# Altium schematic sheet Fri3D_2026_02.SchDoc: Top Level
size A3; Date: 27/02/2026; DrawnBy: Wim Van Gool; DocumentNumber: 1; Revision: 01; SheetNumber: 1; SheetTotal: 5
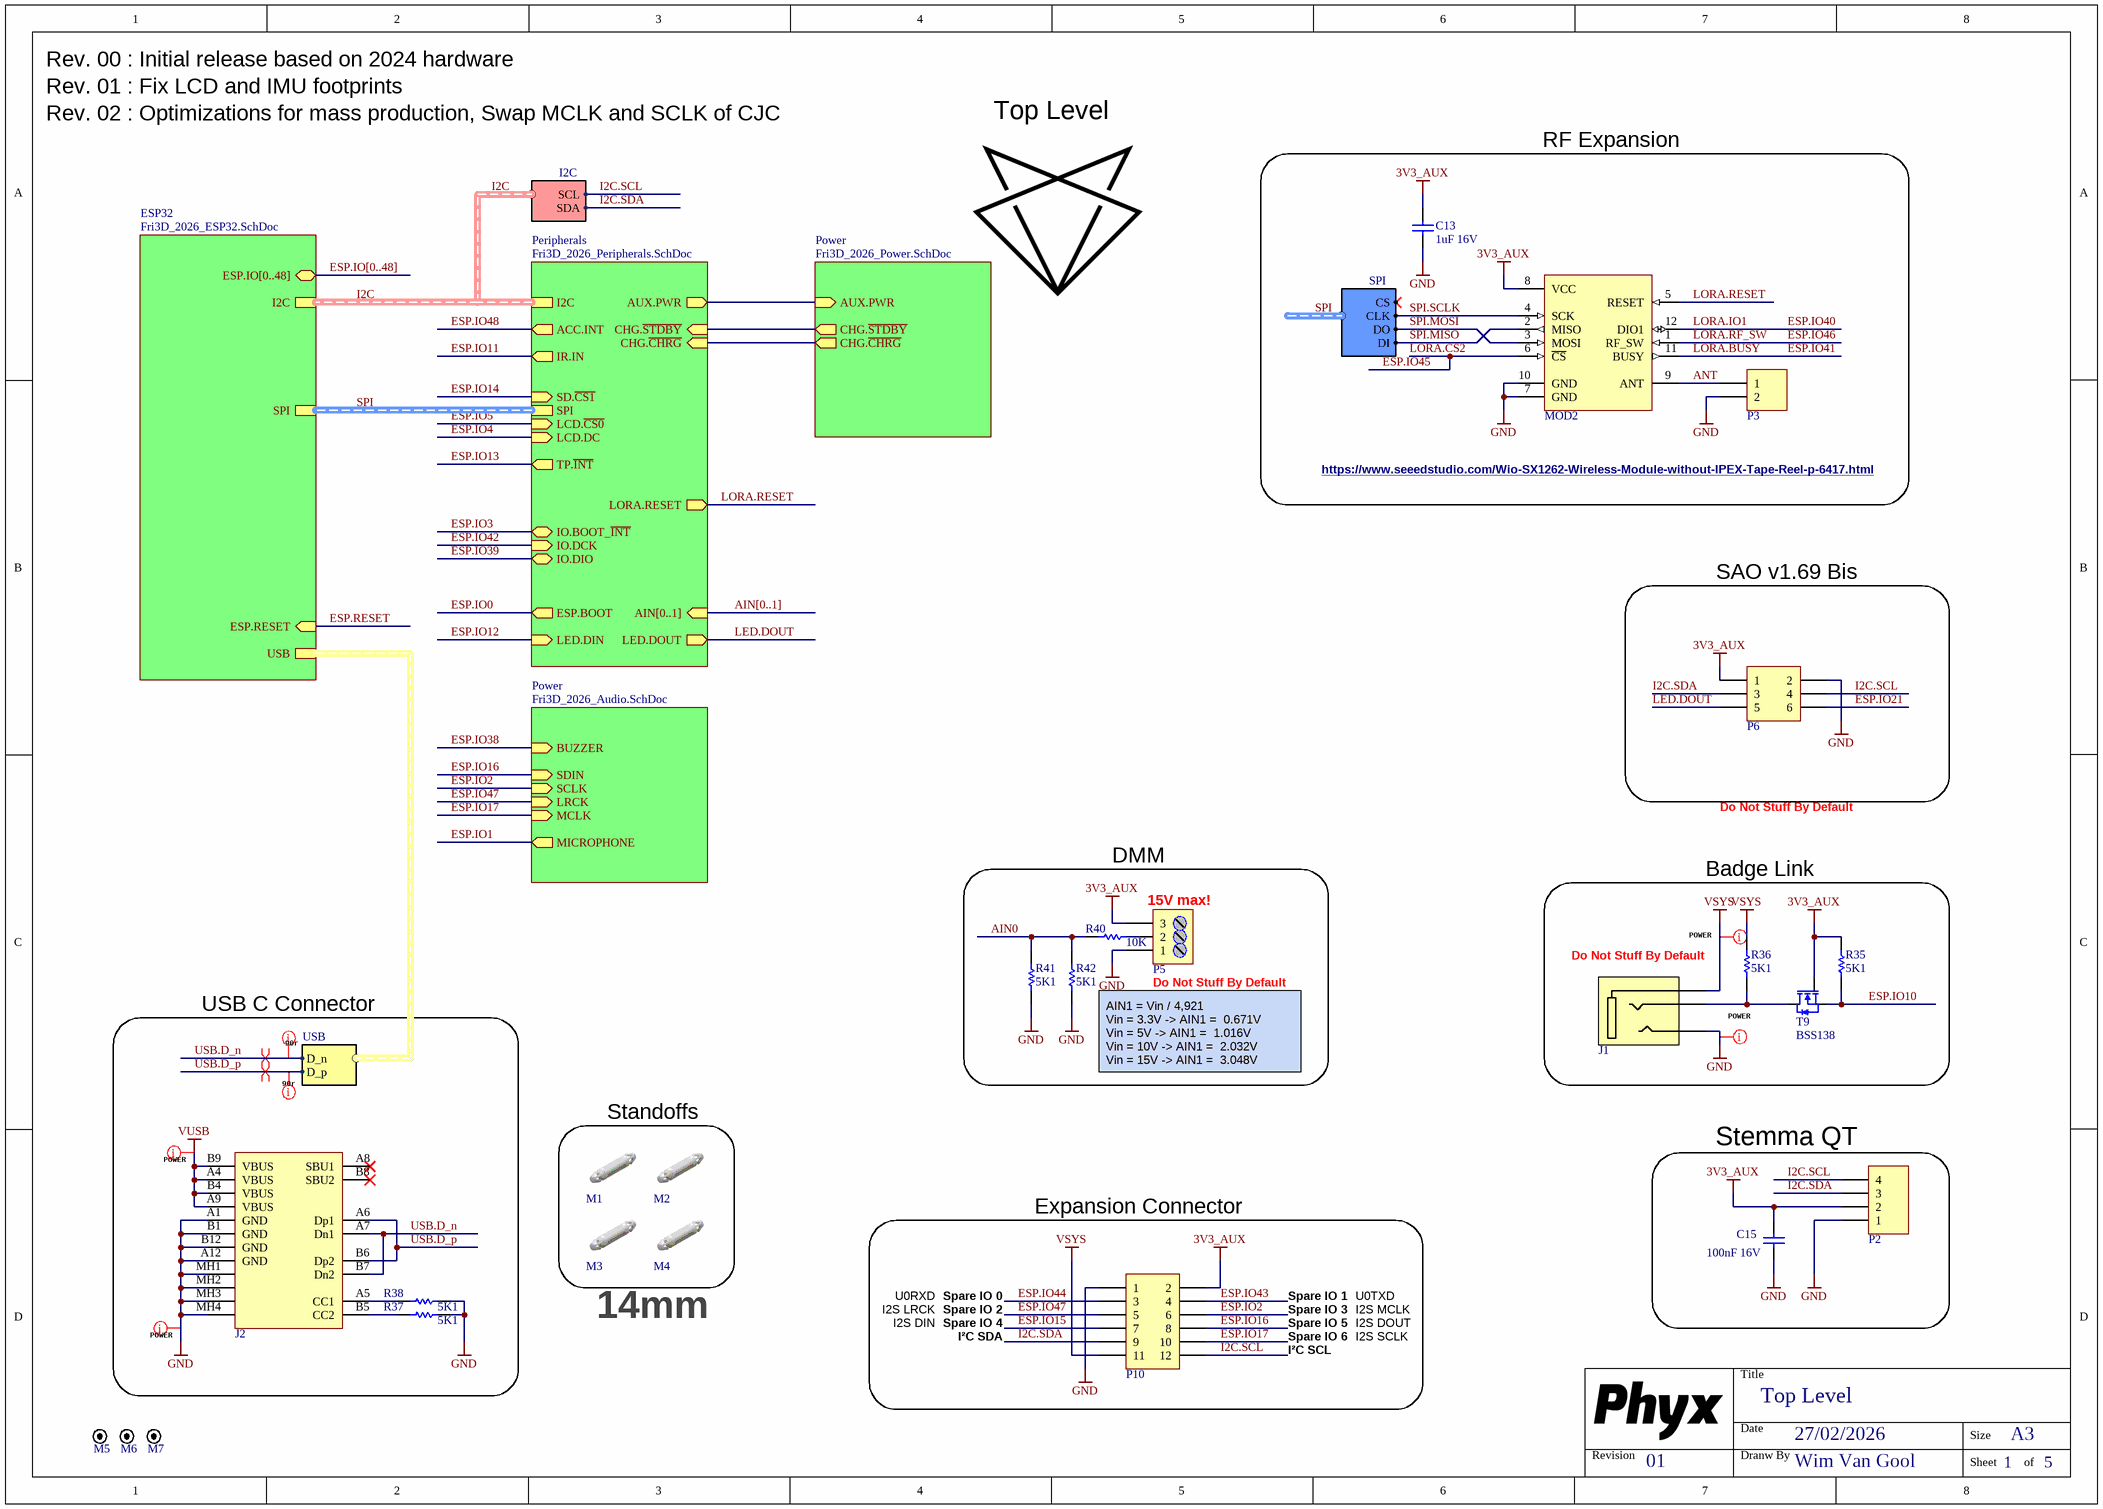
[diagram p0: Fri3D_2026_02.SchDoc]

## Parts
C13  value 1uF 16V  [C0603_N]
C15  value 100nF 16V  [C0603_N]
J1  3.5mm jack, black, 3 contacts  [SHOU_HAN_PJ-320A-3P]  (value not drawn)
J2  USB 2.0 C Reversible Receptacle Horizontal full SMD  [XUNPU-TYPEC-304S-ACP16]  (value not drawn)
M1  HIWA LCC-12 Snap-in - Snap-in 12.7mm  [WE_709622400]  (value not drawn)
M2  HIWA LCC-12 Snap-in - Snap-in 12.7mm  [WE_709622400]  (value not drawn)
M3  HIWA LCC-12 Snap-in - Snap-in 12.7mm  [WE_709622400]  (value not drawn)
M4  HIWA LCC-12 Snap-in - Snap-in 12.7mm  [WE_709622400]  (value not drawn)
M5  Fiducial 0.5mm  [FID_0.5mm]  (value not drawn)
M6  Fiducial 0.5mm  [FID_0.5mm]  (value not drawn)
M7  Fiducial 0.5mm  [FID_0.5mm]  (value not drawn)
MOD2  868/915MHz 22dBm LoRa Module with Antenna Pin  [SEE_Wio-SX1262]  (value not drawn)
P2  Header 1.0mm RA Shrouded 4  [WE_665104131822]  (value not drawn)
P3  DEALON DL-SMA-K513-08K  [DEA_DL-SMA-K513-08K]  (value not drawn)
P5  3 Way Screw HDR 3.5mm Rising Cage  [WE_691103110003]  (value not drawn)
P6  Receptacle 3x2  [RCPT2X3]  (value not drawn)
P10  Receptacle 6x2 SMD low profile  [WE_610312243021_POST]  (value not drawn)
R35  value 5K1  [R0603_N]
R36  value 5K1  [R0603_N]
R37  value 5K1  [R0603_N]
R38  value 5K1  [R0603_N]
R40  value 10K  [R0603_N]
R41  value 5K1  [R0603_N]
R42  value 5K1  [R0603_N]
T9  value BSS138  [SOT23-3]  (hidden comment: 0.2A N-Ch MOSFET Vgs 3.2)

## Blocks framed on the sheet
RF Expansion: C13 MOD2 P3
SAO v1.69 Bis: P6
DMM: P5 R40-R42
Badge Link: J1 R35 R36 T9
USB C Connector: J2 R37 R38
Standoffs: M1-M4
Stemma QT: C15 P2
Expansion Connector: P10

## Sub-sheets
ESP32 = Fri3D_2026_ESP32.SchDoc: I2C (harness I2C), USB (harness USB), SPI (harness SPI), ESP.RESET (in), ESP.IO[0..48] (bidir)
Peripherals = Fri3D_2026_Peripherals.SchDoc: I2C (harness I2C), ACC.INT (out), LED.DIN (in), LED.DOUT (out), SPI (harness SPI), IR.IN (out), LCD.DC (in), LCD.~{CS0} (in), ESP.BOOT (out), SD.~{CS1} (in), IO.BOOT_~{INT} (bidir), IO.DCK (in), IO.DIO (bidir), AUX.PWR (out), TP.~{INT} (out), CHG.~{STDBY} (in), CHG.~{CHRG} (in), AIN[0..1] (in), LORA.RESET (out)
Power = Fri3D_2026_Power.SchDoc: AUX.PWR (in), CHG.~{STDBY} (out), CHG.~{CHRG} (out)
Power = Fri3D_2026_Audio.SchDoc: BUZZER (in), MICROPHONE (out), SDIN (in), SCLK (in), LRCK (in), MCLK (in)

## Harnesses
USB: D_p, D_n
I2C: SDA, SCL
SPI: CS, CLK, DO, DI

## Nets
3V3_AUX: C13.1 C15.1 MOD2.8(VCC) P2.2 P5.3 P6.1 P10.2 R35.1 T9.1(G)
GND: C13.2 C15.2 J1.2(Tip) J2.A1(GND) J2.A12(GND) J2.B1(GND) J2.B12(GND) J2.MH1(Tab) J2.MH2(Tab) J2.MH3(Tab) J2.MH4(Tab) MOD2.7(GND) MOD2.10(GND) P2.1 P3.2 P5.1 P6.2 P10.1 R37.2 R38.2 R41.1 R42.1
VSYS: J1.1(Sleeve) P10.11 R36.1
VUSB: J2.A4(VBUS) J2.A9(VBUS) J2.B4(VBUS) J2.B9(VBUS)
AIN0: R40.1 R41.2 R42.2
ANT: MOD2.9(ANT) P3.1
ESP.IO0: sheet Peripherals/ESP.BOOT
ESP.IO1: sheet Power/MICROPHONE
ESP.IO2: P10.6 ; sheet Power/SCLK
ESP.IO3: sheet Peripherals/IO.BOOT_~{INT}
ESP.IO4: sheet Peripherals/LCD.DC
ESP.IO5: sheet Peripherals/LCD.~{CS0}
ESP.IO10: R35.2 T9.2(S)
ESP.IO11: sheet Peripherals/IR.IN
ESP.IO12: sheet Peripherals/LED.DIN
ESP.IO13: sheet Peripherals/TP.~{INT}
ESP.IO14: sheet Peripherals/SD.~{CS1}
ESP.IO15: P10.7
ESP.IO16: P10.8 ; sheet Power/SDIN
ESP.IO17: P10.10 ; sheet Power/MCLK
ESP.IO21: P6.6
ESP.IO38: sheet Power/BUZZER
ESP.IO39: sheet Peripherals/IO.DIO
ESP.IO40: MOD2.12(DIO1)  [also labelled LORA.IO1]
ESP.IO41: MOD2.11(BUSY)  [also labelled LORA.BUSY]
ESP.IO42: sheet Peripherals/IO.DCK
ESP.IO43: P10.4
ESP.IO44: P10.3
ESP.IO45: MOD2.6(~{CS})  [also labelled LORA.~{CS2}]
ESP.IO46: MOD2.1(RF_SW)  [also labelled LORA.RF_SW]
ESP.IO47: P10.5 ; sheet Power/LRCK
ESP.IO48: sheet Peripherals/ACC.INT
ESP.RESET: sheet ESP32/ESP.RESET
I2C.SCL: P2.4 P6.4 P10.12 ; sheet Peripherals/I2C.SCL
I2C.SDA: P2.3 P6.3 P10.9 ; sheet Peripherals/I2C.SDA
LED.DOUT: P6.5 ; sheet Peripherals/LED.DOUT
LORA.RESET: MOD2.5(RESET) ; sheet Peripherals/LORA.RESET
SPI.MISO: MOD2.2(MISO) ; sheet Peripherals/SPI.DI  [project net SPI.DI]
SPI.MOSI: MOD2.3(MOSI) ; sheet Peripherals/SPI.DO  [project net SPI.DO]
SPI.SCLK: MOD2.4(SCK) ; sheet Peripherals/SPI.CLK  [project net SPI.CLK]
USB.D_n: J2.A7(Dn1) J2.B7(Dn2) ; sheet ESP32/USB.D_n
USB.D_p: J2.A6(Dp1) J2.B6(Dp2) ; sheet ESP32/USB.D_p
NetJ1_3: J1.3(Ring) R36.2 T9.3(D)
NetJ2_A5: J2.A5(CC1) R38.1
NetJ2_B5: J2.B5(CC2) R37.1
NetP5_2: P5.2 R40.2
(unnamed): sheet Peripherals/AUX.PWR, sheet Power/AUX.PWR
(unnamed): sheet Peripherals/CHG.~{STDBY}, sheet Power/CHG.~{STDBY}
(unnamed): sheet Peripherals/CHG.~{CHRG}, sheet Power/CHG.~{CHRG}

Not connected (* = marked no-connect by the designer): J2 A8(SBU1)* B8(SBU2)*

## Buses and harness runs
bus AIN[0..1] = sheet Peripherals/AIN[0..1]
bus ESP.IO[0..48] = sheet ESP32/ESP.IO[0..48]
harness I2C = sheet ESP32/I2C = sheet Peripherals/I2C
harness SPI = sheet ESP32/SPI = sheet Peripherals/SPI

## Layout directives
net class 90r: USB.D_n, USB.D_p
differential pair: USB.D_n, USB.D_p
net class POWER: GND, VSYS, VUSB

## Notes on the sheet
- Rev. 00 : Initial release based on 2024 hardware
- Rev. 01 : Fix LCD and IMU footprints
- Rev. 02 : Optimizations for mass production, Swap MCLK and SCLK of CJC
- https://www.seeedstudio.com/Wio-SX1262-Wireless-Module-without-IPEX-Tape-Reel-p-6417.html
- Do Not Stuff By Default
- (near P5) 15V max!
- (near P5) Do Not Stuff By Default
- AIN1 = Vin / 4,921
  Vin = 3.3V -> AIN1 =  0.671V
  Vin = 5V -> AIN1 =  1.016V
  Vin = 10V -> AIN1 =  2.032V
  Vin = 15V -> AIN1 =  3.048V
- 14mm
- I2S LRCK
- I2S DIN
- U0RXD
- Spare IO 0
- I²C SDA
- Spare IO 2
- Spare IO 4
- Spare IO 1
- Spare IO 3
- Spare IO 5
- Spare IO 6
- I2S MCLK
- I2S SCLK
- I2S DOUT
- U0TXD
- I²C SCL
- Title
- Revision
- Date
- Dranw By
- Size
- A3
- Sheet
- of

## Library data of the parts
C13 = CAP # 1uF 16V 0603: Capacitor Ceramic; Supplier 1: Farnell; Supplier Part Number 1: 2320814; Supplier 2: LCSC; Supplier 3: Generic; Supplier Part Number 2: C1592; Supplier Part Number 3: 1uF 16V 0603 X7R
C15 = CAP # 100nF 16V 0603: Capacitor Ceramic; Supplier 1: LCSC; Supplier 3: Generic; Supplier Part Number 1: C282519; Supplier Part Number 3: 100nF 16V 0603 X7R
J1 = AUDIO JACK 3.5 3c PJ-320A-3P: =Description; Value: PJ-320A-3P; Supplier 1: LCSC; Supplier Part Number 1: C17701689; Supplier 2: LCSC; Supplier Part Number 2: C19189087
J2 = USB # C 2.0 RCPT TYPEC-304S-ACP16: Value: TYPEC-304S-ACP16; Supplier 1: LCSC; Supplier Part Number 1: C5187472; Supplier 2: LCSC; Supplier 3: LCSC; Supplier Part Number 2: C2927040; Supplier Part Number 3: C5156603
M1-M4 = SPACER SNAP-SNAP LCC-12 -12.7mm: Value: LCC-12; Supplier 1: LCSC; Supplier Part Number 1: C155856
M5-M7 = Fiducial 0.5mm: FIDUCIAL; Value: NO BOM; Supplier 1: XXX; Supplier Part Number 1: FOOTPRINT ONLY
MOD2 = RF # MOD Wio-SX1262-N 868MHz LoRa ANT pin: =Description; Value: Wio-SX1262-N; Supplier 1: Seeed Studio; Supplier Part Number 1: 113991436; Supplier 2: Digi-key; Supplier Part Number 2: 1597-113991436-ND
P2 = HDR # RA SHR 1.0mm 4way - 665104131822: Value: 665104131822; Supplier 1: Wurth; Supplier Part Number 1: 665104131822; Supplier 2: Mouser; Supplier Part Number 2: 710-665104131822; Supplier 3: LCSC; Supplier Part Number 3: C2905006
P3 = RF # SMA DL-SMA-K513-08K: Value: DL-SMA-K513-08K; Supplier 1: LCSC; Supplier Part Number 1: C4749212
P5 = Terminal Block 3.5mm 3way: Supplier 1: LCSC; Supplier Part Number 1: C784941; Supplier 2: Würth; Supplier Part Number 2: 691214110003
P6 = Receptacle 2.54mm dual row 6way: Supplier 1: LCSC; Supplier 2: LCSC; Supplier Part Number 1: C92272; Supplier Part Number 2: C358725
P10 = Receptacle # 2.54mm dual row 12way 610312243021: Value: 610312243021; Supplier 1: Wurth; Supplier Part Number 1: 610312243021; Supplier 2: Mouser; Supplier Part Number 2: 710-610312243021
R35-R38 R41 R42 = RES # 5K1 0603: Supplier 1: Farnell; Supplier Part Number 1: 2845922; Supplier 2: LCSC; Supplier 3: Generic; Supplier Part Number 2: C112314; Supplier Part Number 3: 5K1 1% 0603
R40 = RES # 10K 0603: Supplier 1: Farnell; Supplier Part Number 1: 2502397; Supplier 2: LCSC; Supplier 3: Generic; Supplier Part Number 2: C25804; Supplier Part Number 3: 10K 1% 0603
T9 = BSS138 N-Ch MOSFET 0.2A 3.2Vgs 60Vds: Supplier 1: Farnell; Supplier Part Number 1: 2432717